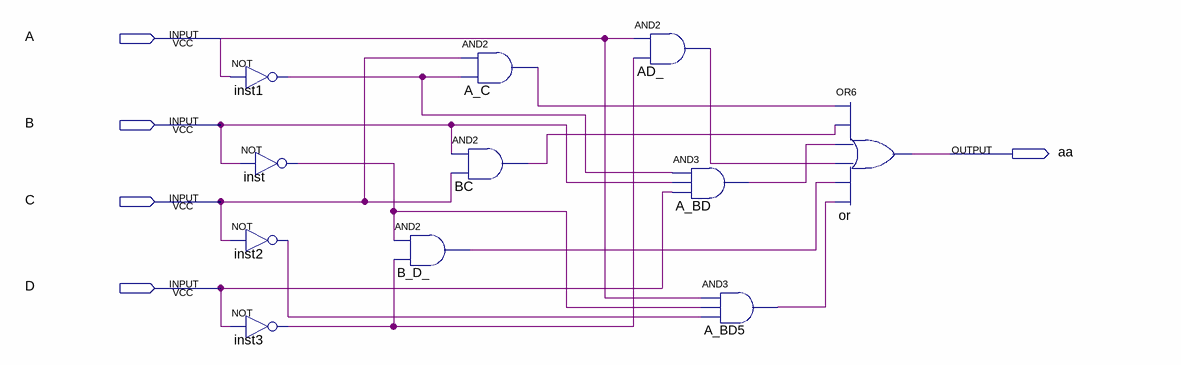
[diagram p0: schematic sheet]
// Quartus schematic output_a.bdf as structural Verilog: 11 symbols, 5 pins
module output_a (
  input  A,
  input  B,
  input  C,
  input  D,
  output aa
);

  wire A_BD5_out, A_BD_out, A_C_out, AD__out, B_D__out, BC_out, inst1_out, inst2_out, inst3_out, inst_out;

  not inst1 (inst1_out, A);
  not inst2 (inst2_out, C);
  not inst3 (inst3_out, D);
  not inst (inst_out, B);
  and A_C (A_C_out, C, inst1_out);
  and BC (BC_out, B, C);
  and B_D_ (B_D__out, inst_out, inst3_out);
  and AD_ (AD__out, A, inst3_out);
  and A_BD (A_BD_out, inst1_out, B, D);
  and A_BD5 (A_BD5_out, A, inst_out, inst2_out);
  or \or  (aa, A_C_out, BC_out, A_BD_out, AD__out, B_D__out, A_BD5_out);
endmodule
